# EasyEDA Pro project ProPrj_ESP32 Touchpad.epro, schematic Schematic2
Assembly Variant: Basic; Board Name: Board2; Create Date: 2026-01-15; Page Name: P1; Project Name: ESP32 Touchpad; Schematic Name: Schematic2; Update Date: 2026-01-15; BladeWidth: 10; Company: 嘉立创EDA; Page Size: A4; RegionStart: 1; ShowBorder: 1; TitleBlock: 1; TitleBlockPosition: 3; Version: V1.0; XRegionCount: 6; YRegionCount: 4
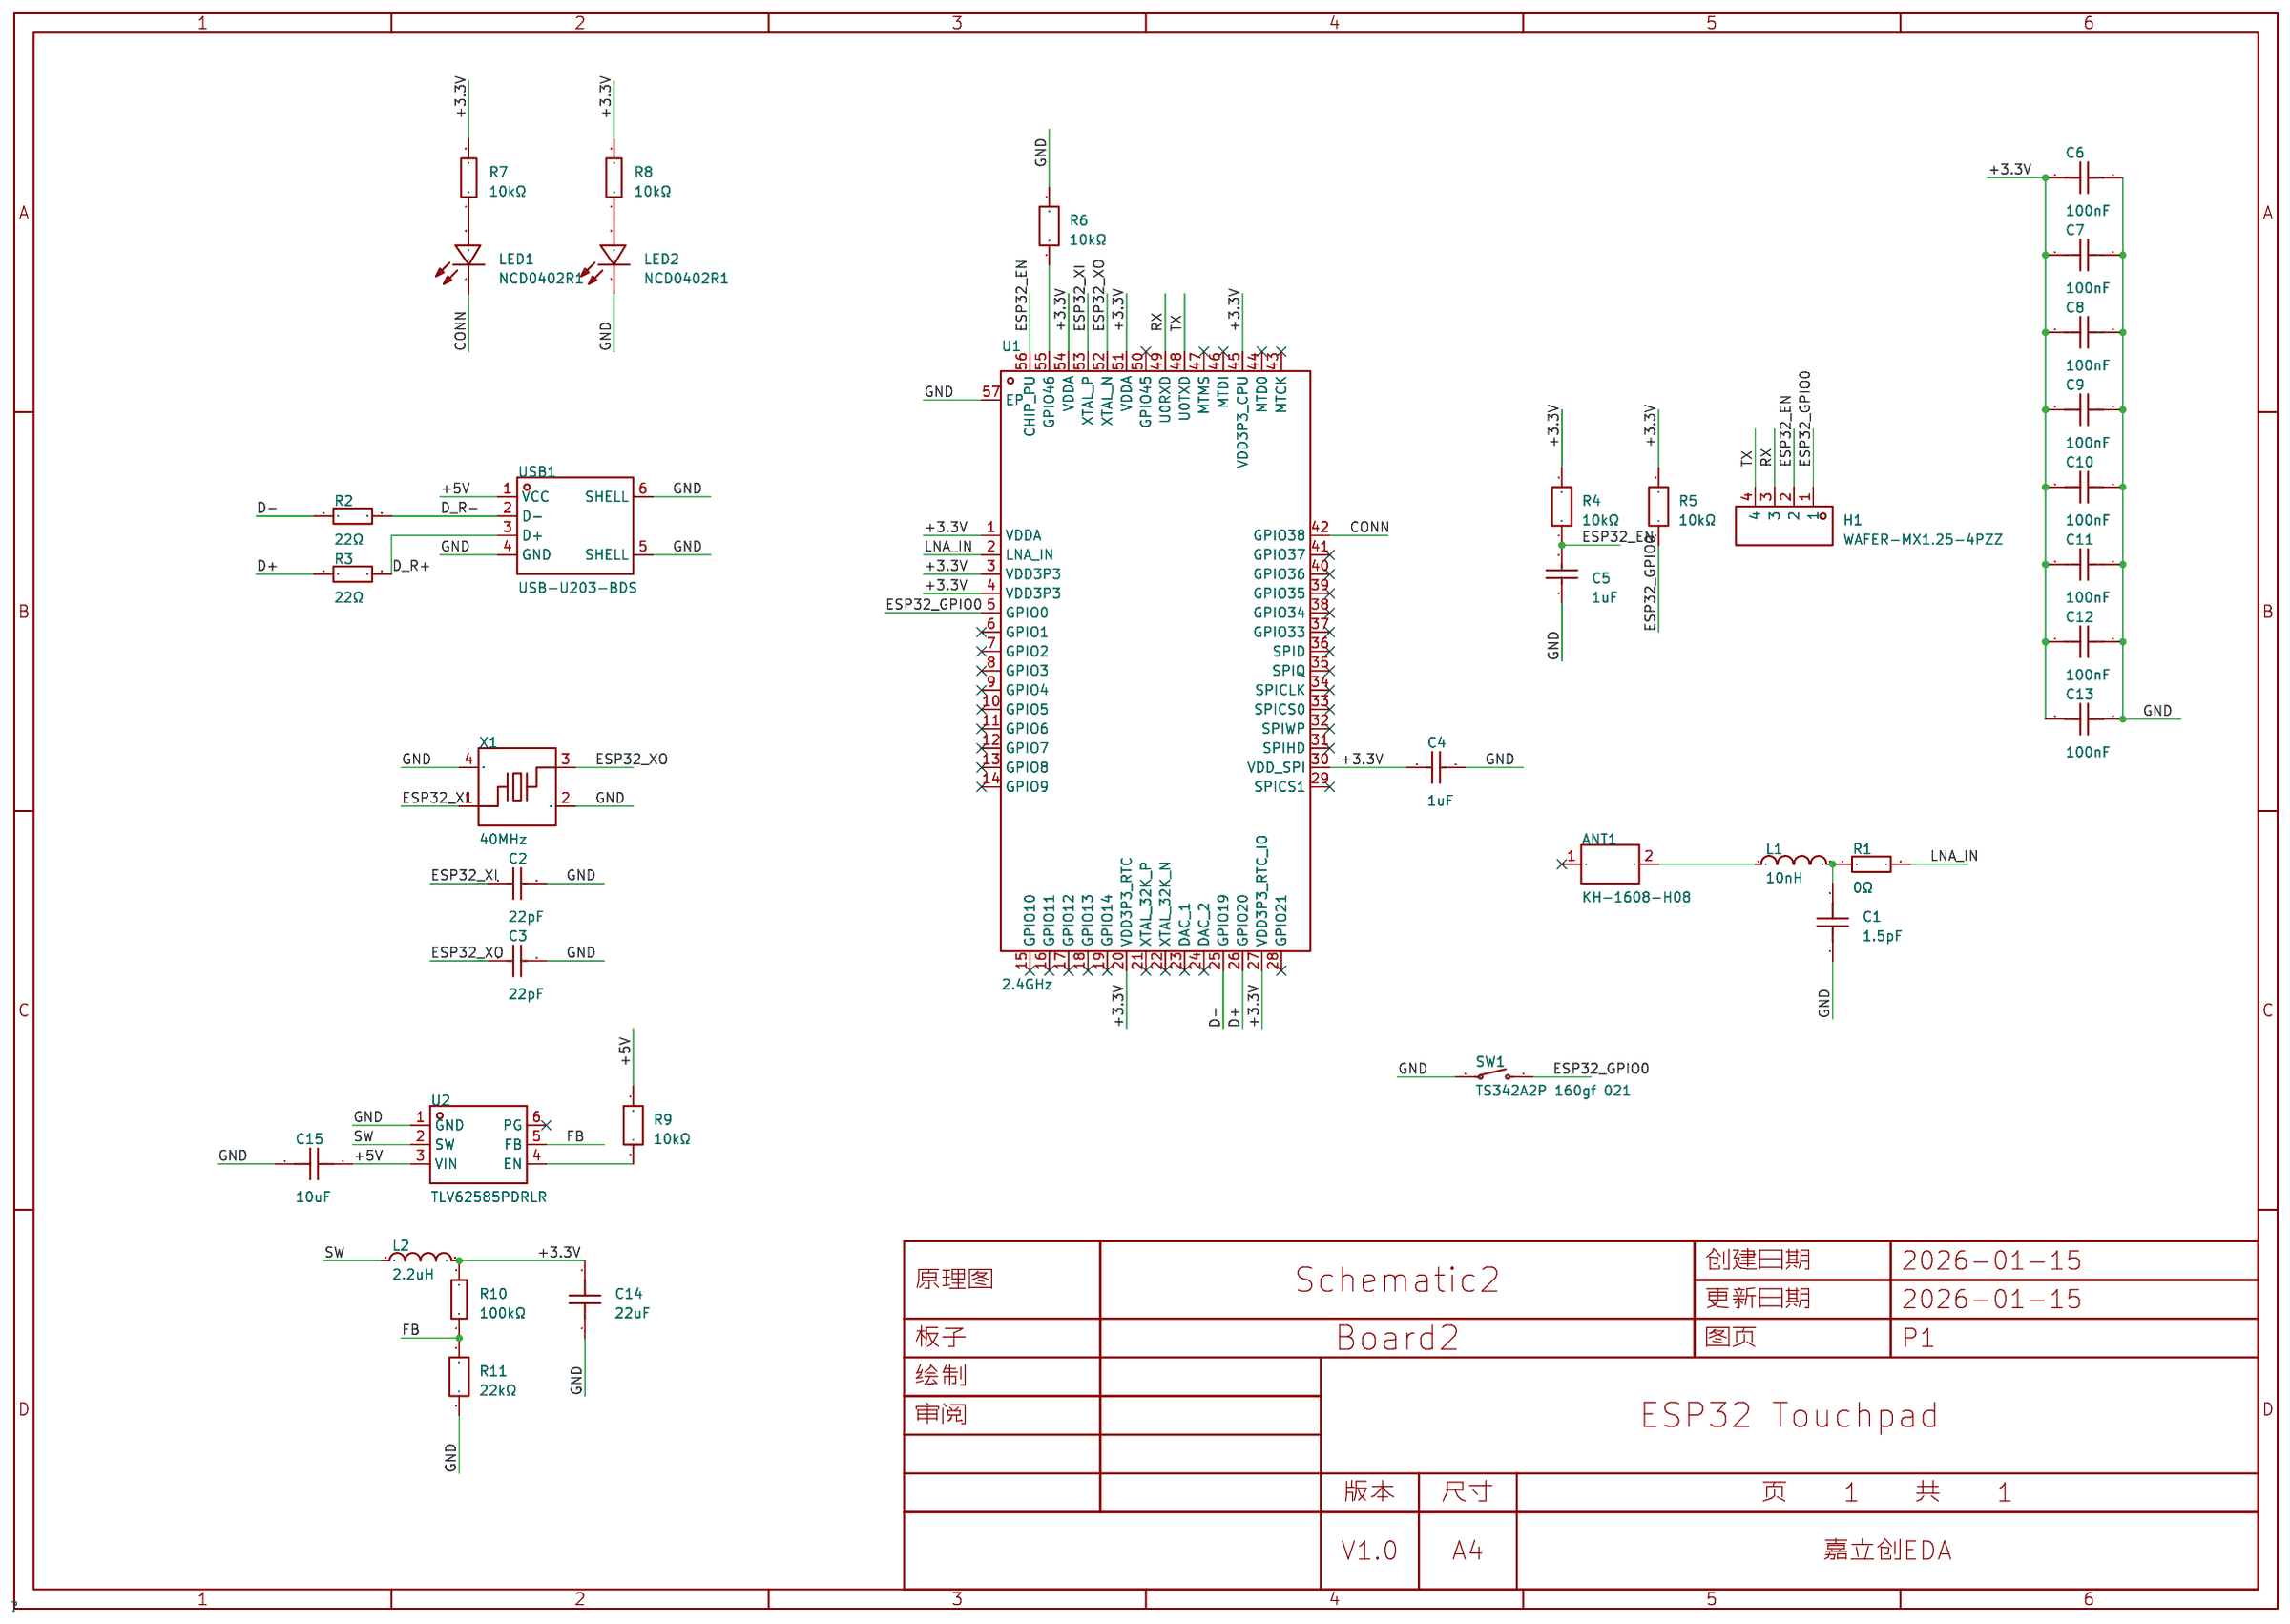
[diagram p0: schematic sheet]

## Parts
ANT1  KH-1608-H08  [ANT-SMD_L1.7-W0.9]
C1  1.5pF  [C0402]
C2  22pF  [C0201]
C3  22pF  [C0201]
C4  1uF  [C0201]
C5  1uF  [C0201]
C6  100nF  [C0201]
C7  100nF  [C0201]
C8  100nF  [C0201]
C9  100nF  [C0201]
C10  100nF  [C0201]
C11  100nF  [C0201]
C12  100nF  [C0201]
C13  100nF  [C0201]
C14  22uF  [C0402]
C15  10uF  [C0402]
H1  WAFER-MX1.25-4PZZ  [CONN-TH_4P-P1.25_WAFER-MX1.25-4PZZ]
L1  10nH  [L0402-RD]
L2  2.2uH  [IND-SMD_L2.0-W1.2_FTC201210S]
LED1  NCD0402R1  [LED0402-RD]
LED2  NCD0402R1  [LED0402-RD]
R1  0Ω  [R0402_1]
R2  22Ω  [R0201]
R3  22Ω  [R0201]
R4  10kΩ  [R0201]
R5  10kΩ  [R0201]
R6  10kΩ  [R0201]
R7  10kΩ  [R0402]
R8  10kΩ  [R0402]
R9  10kΩ  [R0201]
R10  100kΩ  [R0201]
R11  22kΩ  [R0201]
SW1  TS342A2P 160gf 021  [KEY-SMD_L3.9-W3.0-LS5.0]
U1  2.4GHz  [QFN-56_L7.0-W7.0-P0.40-TL-EP4.6]
U2  TLV62585PDRLR  [SOT-563_L1.6-W1.2-P0.50-LS1.6-BL]
USB1  USB-U203-BDS  [USB-SMD_USB-U203-BDS]
X1  40MHz  [CRYSTAL-SMD_4P-L1.6-W1.2-BL]

## Library data of the parts
ANT1 = KH-1608-H08: 中心频率:2.45GHz;带宽:120MHz;增益:2.28dBi;功率:4W;; Supplier Part: C2925416; Manufacturer: kinghelm(金航标); Supplier Footprint: 0603; JLCPCB Part Class: Extended Part; Datasheet: https://item.szlcsc.com/datasheet/KH-1608-H08/3244678.html; Supplier: LCSC; Frequency(Center/Band): 2.45GHz; Bandwidth: 120MHz; Peak Gain: 2.28dBi; Impedance: 50Ω; Power: 4W; Operating Temperature: -40℃~+110℃; Length: 1.7mm; Width: 0.93mm; Height: 0.75mm
C1 = GJM1555C1H1R5BB01D: 容值:1.5pF;额定电压:50V;温度系数:C0G;; LCSC Part Name: ±0.1pF 1.5pF 50V; Supplier Part: C76900; Manufacturer: muRata(村田); Supplier Footprint: 0402; JLCPCB Part Class: Extended Part; Datasheet: https://item.szlcsc.com/datasheet/GJM1555C1H1R5BB01D/78027.html; Supplier: LCSC; Voltage Rating: 50V; Temperature Coefficient: C0G
C2 C3 = GRM0335C1H220JA01D: 容值:22pF;精度:±5%;额定电压:50V;材质(温度系数):C0G;; LCSC Part Name: 22pF ±5% 50V; Supplier Part: C76924; Manufacturer: muRata(村田); Supplier Footprint: 0201; JLCPCB Part Class: Extended Part; Datasheet: https://atta.szlcsc.com/upload/public/pdf/source/20180307/C76924_15204090903111407714.pdf; Supplier: LCSC; Tolerance: ±5%; Voltage Rated: 50V; Temperature Coefficient: C0G
C4 C5 = GRM033R61A105ME44D: 容值:1uF;精度:±20%;额定电压:10V;温度系数:X5R;; LCSC Part Name: 1uF ±20% 10V; Supplier Part: C76935; Manufacturer: muRata(村田); Supplier Footprint: 0201; JLCPCB Part Class: Extended Part; Datasheet: https://item.szlcsc.com/datasheet/GRM033R61A105ME44D/78062.html; Supplier: LCSC; Tolerance: ±20%; Voltage Rating: 10V; Temperature Coefficient: X5R
C6-C13 = GRM033Z71C104KE14D: 容值:100nF;精度:±10%;额定电压:16V;温度系数:X7R;; LCSC Part Name: 100nF ±10% 16V; Supplier Part: C668346; Manufacturer: muRata(村田); Supplier Footprint: 0201; JLCPCB Part Class: Extended Part; Datasheet: https://item.szlcsc.com/datasheet/GRM033Z71C104KE14D/698285.html; Supplier: LCSC; Tolerance: ±10%; Voltage Rating: 16V; Temperature Coefficient: X7R
C14 = GRM155R60J226ME11D: 容值:22uF;精度:±20%;额定电压:6.3V;温度系数:X5R;; LCSC Part Name: 22uF ±20% 6.3V; Supplier Part: C415703; Manufacturer: muRata(村田); Supplier Footprint: 0402; JLCPCB Part Class: Extended Part; Datasheet: https://atta.szlcsc.com/upload/public/pdf/source/20200305/C490387_23319AE8C154DEB24C505E6C82A8106A.pdf; Supplier: LCSC; Tolerance: ±20%; Voltage Rating: 6.3V; Temperature Coefficient: X5R
C15 = CL05A106MP5NUNC: 容值:10uF;精度:±20%;额定电压:10V;温度系数:X5R;; LCSC Part Name: 10uF ±20% 10V; Supplier Part: C315248; Manufacturer: SAMSUNG(三星); Supplier Footprint: 0402; JLCPCB Part Class: 扩展库; Datasheet: https://item.szlcsc.com/datasheet/CL05A106MP5NUNC/297154.html; Supplier: LCSC; Tolerance: ±20%; Voltage Rating: 10V; Temperature Coefficient: X5R
H1 = WAFER-MX1.25-4PZZ: 插针结构:1x4P;间距:1.25mm;安装方式:直插;参考系列:PicoBlade(MX 1.25);总PIN数:4P;排数:1;每排PIN数:4;行距:-;额定电流:1A;触头材质:黄铜;触头镀层:-;工作温度:-25℃~+85℃;; LCSC Part Name: 1x4P 间距:1.25mm 直插 系列:PicoBlade(MX 1.25); Supplier Part: C3029397; Manufacturer: XUNPU(讯普); Supplier Footprint: 插件,P=1.25mm; JLCPCB Part Class: 扩展库; Datasheet: https://atta.szlcsc.com/upload/public/pdf/source/20220527/74EE44A637E2E6AE073051F308D41465.pdf; Supplier: LCSC; Pins Structure: 1x4P; Pitch: 1.25mm; Mounting Type: 直插; Reference Series: PicoBlade(MX 1.25); Number of Pins: 4P; Number of Rows: 1; Number of PINs Per Row: 4; Current Rating: 1A; Contact Material: 黄铜; Operating Temperature: -25℃~+85℃; Voltage Rating: 125V; Plastic Material: LCP; Color: 米色; Z-Height of the Board: 4.6mm; Y-Width of Bottom Edge on Board: 3.3mm
L1 = LQG15HS10NJ02D: 电感值:10nH;精度:±5%;额定电流:500mA;饱和电流(Isat):-;直流电阻(DCR):260mΩ;; LCSC Part Name: 10nH ±5%; Supplier Part: C77103; Manufacturer: muRata(村田); Supplier Footprint: 0402; JLCPCB Part Class: Extended Part; Datasheet: https://item.szlcsc.com/datasheet/LQG15HS10NJ02D/78230.html; Supplier: LCSC; Tolerance: ±5%; Current Rating: 500mA; DC Resistance(DCR): 260mΩ; Q @ Frequency: 8@100MHz; Frequency - Self Resonant: 3.4GHz
L2 = FTC201210S2R2MBCA: 电感值:2.2uH;精度:±20%;额定电流:2A;饱和电流(Isat):2.7A;类型:一体成型电感;; LCSC Part Name: 2.2uH ±20% 2.7A; Supplier Part: C5832324; Manufacturer: cjiang(长江微电); Supplier Footprint: SMD,1.2x2mm; JLCPCB Part Class: 扩展库; Datasheet: https://atta.szlcsc.com/upload/public/pdf/source/20230602/8FFEDA9C0247A92A0D4B67554BFE4091.pdf; Supplier: LCSC; Tolerance: ±20%; Rated Current: 2A; Saturation Current (Isat): 2.7A; DC Resistance (DCR): 135mΩ; Type: 一体成型电感
LED1 LED2 = NCD0402R1: 发光颜色:红色;正向电压(VF):1.6V~2.6V;功率:65mW;正向电流:5mA;主波长:615nm~635nm;透镜颜色:无色透明透镜;发光强度:13mcd~30mcd;发光角度:130°;工作温度:-30℃~+85℃;; Supplier Part: C130719; Manufacturer: 国星光电; Supplier Footprint: 0402; JLCPCB Part Class: 扩展库; Datasheet: https://atta.szlcsc.com/upload/public/pdf/source/20200820/C130719_A72EA5A7FEC83C35856EA0453E4EE775.pdf; Supplier: LCSC; Emitted Color: 红色; Forward Voltage (VF): 1.6V~2.6V; Power Dissipation: 65mW; Forward Current: 5mA; Dominant Wavelength: 615nm~635nm; Lens Color: 无色透明透镜; Luminous Intensity: 13mcd~30mcd; Viewing Angle: 130°; Operating Temperature: -30℃~+85℃
R1 = 0402WGF0000TCE: 电阻类型:厚膜电阻;阻值:0Ω;精度:±1%;功率:62.5mW;最大工作电压:50V;温度系数:±800ppm/℃;; LCSC Part Name: 0Ω ±1% 62.5mW 厚膜电阻; Supplier Part: C17168; Manufacturer: UNI-ROYAL(厚声); Supplier Footprint: 0402; JLCPCB Part Class: 基础库; Datasheet: https://atta.szlcsc.com/upload/public/pdf/source/20200306/C422600_1E6D84923E4A46A82E41ADD87F860B5C.pdf; Supplier: LCSC; Type: 厚膜电阻; Tolerance: ±1%; Power(Watts): 62.5mW; Overload Voltage (Max): 50V; Temperature Coefficient: ±800ppm/℃; Operating Temperature Range: -55℃~+155℃
R2 R3 = 0201WMF220JTEE: 电阻类型:厚膜电阻;阻值:22Ω;精度:±1%;功率:50mW;工作电压:25V;温度系数:±200ppm/℃;; LCSC Part Name: 22Ω ±1% 50mW 厚膜电阻; Supplier Part: C270355; Manufacturer: UNI-ROYAL(厚声); Supplier Footprint: 0201; JLCPCB Part Class: Extended Part; Datasheet: https://item.szlcsc.com/datasheet/0201WMF220JTEE/259885.html; Supplier: LCSC; Type: 厚膜电阻; Tolerance: ±1%; Power(Watts): 50mW; Voltage-Supply(Max): 25V; Temperature Coefficient: ±200ppm/℃; Operating Temperature: -55℃~+155℃
R4-R6 R9 = 0201WMF1002TEE: 电阻类型:厚膜电阻;阻值:10kΩ;精度:±1%;功率:50mW;最大工作电压:25V;温度系数:±200ppm/℃;; LCSC Part Name: 10kΩ ±1% 50mW 厚膜电阻; Supplier Part: C473048; Manufacturer: UNI-ROYAL(厚声); Supplier Footprint: 0201; JLCPCB Part Class: Extended Part; Datasheet: https://atta.szlcsc.com/upload/public/pdf/source/20200306/C422600_1E6D84923E4A46A82E41ADD87F860B5C.pdf; Supplier: LCSC; Type: 厚膜电阻; Tolerance: ±1%; Power(Watts): 50mW; Overload Voltage (Max): 25V; Temperature Coefficient: ±200ppm/℃; Operating Temperature Range: -55℃~+155℃
R7 R8 = 0402WGF1002TCE: 电阻类型:厚膜电阻;阻值:10kΩ;精度:±1%;功率:62.5mW;工作电压:50V;温度系数:±100ppm/℃;; LCSC Part Name: 10kΩ ±1% 62.5mW 厚膜电阻; Supplier Part: C25744; Manufacturer: UNI-ROYAL(厚声); Supplier Footprint: 0402; JLCPCB Part Class: Basic Part; Datasheet: https://item.szlcsc.com/datasheet/0402WGF1002TCE/26487.html; Supplier: LCSC; Type: 厚膜电阻; Tolerance: ±1%; Power(Watts): 62.5mW; Voltage-Supply(Max): 50V; Temperature Coefficient: ±100ppm/℃; Operating Temperature: -55℃~+155℃
R10 = 0201WMF1003TEE: 电阻类型:厚膜电阻;阻值:100kΩ;精度:±1%;功率:50mW;最大工作电压:25V;温度系数:±200ppm/℃;; LCSC Part Name: 100kΩ ±1% 50mW 厚膜电阻; Supplier Part: C270364; Manufacturer: UNI-ROYAL(厚声); Supplier Footprint: 0201; JLCPCB Part Class: Extended Part; Datasheet: https://atta.szlcsc.com/upload/public/pdf/source/20200306/C422600_1E6D84923E4A46A82E41ADD87F860B5C.pdf; Supplier: LCSC; Type: 厚膜电阻; Tolerance: ±1%; Power(Watts): 50mW; Overload Voltage (Max): 25V; Temperature Coefficient: ±200ppm/℃; Operating Temperature Range: -55℃~+155℃
R11 = RC0201FR-0722KL: 电阻类型:厚膜电阻;阻值:22kΩ;精度:±1%;功率:50mW;工作电压:25V;温度系数:±200ppm/℃;; LCSC Part Name: 厚膜电阻 22kΩ ±1% 50mW; Supplier Part: C474416; Manufacturer: YAGEO(国巨); Supplier Footprint: 0201; JLCPCB Part Class: Extended Part; Datasheet: https://item.szlcsc.com/datasheet/RC0201FR-0722KL/480897.html; Supplier: LCSC; Type: 厚膜电阻; Tolerance: ±1%; Power(Watts): 50mW; Voltage-Supply(Max): 25V; Temperature Coefficient: ±200ppm/℃; Operating Temperature: -55℃~+125℃
SW1 = TS342A2P 160gf 021: 电路结构:单刀单掷;按钮形状:圆形按钮;作用力:1.6N;安装方式:立贴;开关长度:-;开关宽度:-;开关高度:-;带支架:不带;触点电流:50mA;额定电压(DC):12V;绝缘电阻:100MΩ;带灯:无;机械寿命:3万次;; LCSC Part Name: 正按小龟 3*4*2mm 两脚不带柱 160gf 黑色塑胶按钮; Supplier Part: C5373431; Manufacturer: SHOU HAN(首韩); Supplier Footprint: SMD; JLCPCB Part Class: Extended Part; Datasheet: https://atta.szlcsc.com/upload/public/pdf/source/20240424/23B385020986CAF015868F86EB8FE759.pdf; Supplier: LCSC; Circuit: 单刀单掷; Actuator Style: 圆形按钮; Operating Force: 1.6N; Mounting Style: 立贴; Strike Gundam: 不带; Contact Current: 50mA; Voltage Rating (DC): 12V; Insulation Resistance: 100MΩ; Actuator/Cap Color: 黑色; With Lamp: 无; Pin Style: SMD接片; Mechanical Life: 3万次; Operating Temperature: -25℃~+70℃
U1 = ESP32-S2FN4R2: 核心芯片:ESP32-S2芯片;频率:2.4GHz;发射功率:19.5dBm;; Supplier Part: C2844252; Manufacturer: ESPRESSIF(乐鑫); Supplier Footprint: QFN-56-EP(7x7); JLCPCB Part Class: Extended Part; Datasheet: https://item.szlcsc.com/datasheet/ESP32-S2FN4R2/3034621.html; Supplier: LCSC; Utilized IC / Part: ESP32-S2芯片; Interface Type: I2C；GPIO；SPI；PWM；ADC；UART；USB；I2S; Output Power: 19.5dBm
U2 = TLV62585PDRLR: 功能类型:降压型;工作电压:2.5V~5.5V;输出电压:600mV~5.5V;输出电流:3A;输出类型:可调;; Supplier Part: C485118; Manufacturer: TI(德州仪器); Supplier Footprint: SOT-563; JLCPCB Part Class: 扩展库; Datasheet: https://www.ti.com/cn/lit/gpn/tlv62585; Supplier: LCSC; Function: 降压型; Voltage - Supply: 2.5V~5.5V; Output Voltage: 600mV~5.5V; Output Current: 3A; Frequency - Switching: 1.5MHz; Operating Temperature: -40℃~+125℃@(TJ); Synchronous Rectifier: 是; Number of Outputs: 1; Topology: 降压式; Quiescent Current: 35uA; Switch tube (built-in/external): 内置; Output Type: 可调
USB1 = USB-U203-BDS: 连接器类型:Type-A;协议标准:USB 2.0;公母:公;安装方式:卧贴;触点数量:4P;端口数量:1;额定电流 - 电源:1.5A;工作温度:0℃~+50℃;; LCSC Part Name: Type-A 公 卧贴; Supplier Part: C2962378; Manufacturer: HANBO(汉博); Supplier Footprint: SMD; JLCPCB Part Class: Extended Part; Datasheet: https://item.szlcsc.com/datasheet/USB-U203-BDS/3352870.html; Supplier: LCSC; Connector Type: Type-A; Protocol Standard: USB 2.0; Gender: 公; Mounting Type: 卧贴; Number of Contacts: 4P; Number of Ports: 1; Current Rating-Power: 1.5A; Voltage Rating: 30V; Connect-Disconnect Life: 1.5千次; Operating Temperature: 0℃~+50℃
X1 = SX0B40.000F0810F30: 晶振类型:贴片晶振;频率:40MHz;常温频差:±10ppm;负载电容:8pF;频率稳定度:±30ppm;; LCSC Part Name: 40MHz ±10ppm 8pF; Supplier Part: C7301926; Manufacturer: SCTF(星通时频); Supplier Footprint: SMD1612-4P; JLCPCB Part Class: Extended Part; Datasheet: https://item.szlcsc.com/datasheet/SX0B40.000F0810F30/8272179.html; Supplier: LCSC; Type: 贴片晶振; Normal temperature Frequency Tolerance: ±10ppm; Load Capacitance: 8pF; Frequency Stability: ±30ppm; Equivalent Series Resistance(ESR): 80Ω; Operating Temperature: -40℃~+85℃

## Nets
+3.3V: C4.1 C6.1 C7.1 C8.1 C9.1 C10.1 C11.1 C12.1 C13.1 C14.2 L2.2 R4.2 R5.2 R7.2 R8.2 R10.2 U1.1(VDDA) U1.3(VDD3P3) U1.4(VDD3P3) U1.20(VDD3P3_RTC) U1.27(VDD3P3_RTC_IO) U1.30(VDD_SPI) U1.45(VDD3P3_CPU) U1.51(VDDA) U1.54(VDDA)
+5V: C15.2 R9.2 U2.3(VIN) USB1.1(VCC)
GND: C1.1 C2.2 C3.2 C4.2 C5.1 C6.2 C7.2 C8.2 C9.2 C10.2 C11.2 C12.2 C13.2 C14.1 C15.1 LED2.1(K) R6.2 R11.1 SW1.1 U1.57(EP) U2.1(GND) USB1.4(GND) USB1.5(SHELL) USB1.6(SHELL) X1.2(GND) X1.4(GND)
CONN: LED1.1(K) U1.42(GPIO38)
D+: R3.1 U1.26(GPIO20)
D-: R2.1 U1.25(GPIO19)
D_R+: R3.2 USB1.3(D+)
D_R-: R2.2 USB1.2(D-)
ESP32_EN: C5.2 H1.2 R4.1 U1.56(CHIP_PU)
ESP32_GPIO0: H1.1 R5.1 SW1.2 U1.5(GPIO0)
ESP32_XI: C2.1 U1.53(XTAL_P) X1.1
ESP32_XO: C3.1 U1.52(XTAL_N) X1.3
FB: R10.1 R11.2 U2.5(FB)
LNA_IN: R1.2 U1.2(LNA_IN)
RX: H1.3 U1.49(U0RXD)
SW: L2.1 U2.2(SW)
TX: H1.4 U1.48(U0TXD)
$1N8: ANT1.2 L1.1
$1N9: C1.2 L1.2 R1.1
$1N50: R6.1 U1.55(GPIO46)
$1N55: LED1.2(A) R7.1
$1N60: LED2.2(A) R8.1
$1N70: R9.1 U2.4(EN)

Not connected (* = marked no-connect by the designer): ANT1 1*; U1 6(GPIO1)* 7(GPIO2)* 8(GPIO3)* 9(GPIO4)* 10(GPIO5)* 11(GPIO6)* 12(GPIO7)* 13(GPIO8)* 14(GPIO9)* 15(GPIO10)* 16(GPIO11)* 17(GPIO12)* 18(GPIO13)* 19(GPIO14)* 21(XTAL_32K_P)* 22(XTAL_32K_N)* 23(DAC_1)* 24(DAC_2)* 28(GPIO21)* 29(SPICS1)* 31(SPIHD)* 32(SPIWP)* 33(SPICS0)* 34(SPICLK)* 35(SPIQ)* 36(SPID)* 37(GPIO33)* 38(GPIO34)* 39(GPIO35)* 40(GPIO36)* 41(GPIO37)* 43(MTCK)* 44(MTD0)* 46(MTDI)* 47(MTMS)* 50(GPIO45)*; U2 6(PG)*
